# EAGLE design SX70_Flash_Tester_MINI (EAGLE 8.4.3)
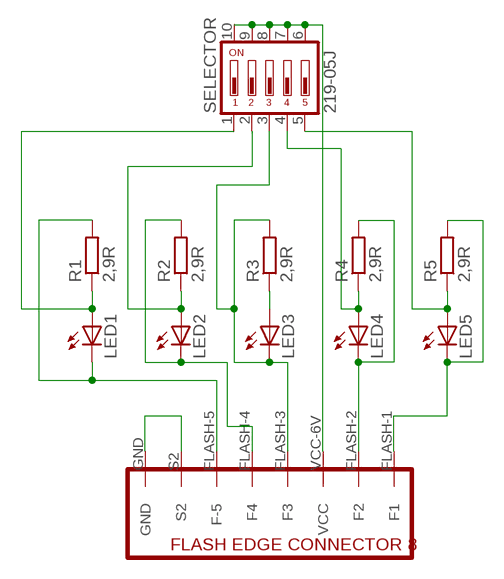
[diagram p0: schematic, sheet 1]

## Parts
FLASH_TESTER  SX70-FLASH-EDGE8-MALE  [SX70-FLASH-EDGE8]
LED1  LEDCHIPLED_0805  [CHIPLED_0805]
LED2  LEDCHIPLED_0805  [CHIPLED_0805]
LED3  LEDCHIPLED_0805  [CHIPLED_0805]
LED4  LEDCHIPLED_0805  [CHIPLED_0805]
LED5  LEDCHIPLED_0805  [CHIPLED_0805]
R1  2,9R  R-EU_M0805  [M0805]
R2  2,9R  R-EU_M0805  [M0805]
R3  2,9R  R-EU_M0805  [M0805]
R4  2,9R  R-EU_M0805  [M0805]
R5  2,9R  R-EU_M0805  [M0805]
SELECTOR  219-05J  [CTS-219-05J]

## Nets
N$1: LED1.A R1.1 SELECTOR.1
N$2: LED2.A R2.1 SELECTOR.2
N$3: LED3.A R3.1
N$4: FLASH_TESTER.VCC-6V(VCC) SELECTOR.6 SELECTOR.7 SELECTOR.8 SELECTOR.9 SELECTOR.10
N$5: LED5.A R5.1 SELECTOR.5
N$6: FLASH_TESTER.FLASH-1(F1) LED5.C R5.2
N$7: FLASH_TESTER.FLASH-2(F2) LED4.C R4.2
N$8: FLASH_TESTER.FLASH-3(F3) LED3.C R3.2 SELECTOR.3
N$9: FLASH_TESTER.FLASH-4(F4) LED2.C R2.2
N$10: FLASH_TESTER.FLASH-5(F-5) LED1.C R1.2
N$11: FLASH_TESTER.GND FLASH_TESTER.S2
N$14: LED4.A R4.1 SELECTOR.4

## Library data of the parts
FLASH_TESTER = openSX70:SX70-FLASH-EDGE8-MALE
LED1-LED5 = led:LED: LED OSRAM: - CHIPLED LG R971, LG N971, LY N971, LG Q971, LY Q971, LO R971, LY R971 LH N974, LH R974 LS Q976, LO Q976, LY Q976 LO Q996 - Hyper CHIPLED LW Q18S LB Q993, LB Q99A, LB R99A - SideLED LS A670, LO A670, LY A670, LG A670, LP A670 LB A673, LV A673, LT A673, LW A673 LH A674 LY A675 LS A676, LA A676, LO A676, LY A676, LW A676 LS A679, LY A679, LG A679 - Hyper Micro SIDELED® LS Y876, LA Y876, LO Y876, LY Y876 LT Y87S - SmartLED LW L88C, LW L88S LB L89C, LB L89S, LG L890 LS L89K, LO L89K, LY L89K LS L896, LA L896, LO L896, LY L896 - TOPLED LS T670, LO T670, LY T670, LG T670, LP T670 LSG T670, LSP T670, LSY T670, LOP T670, LYG T670 LG T671, LOG T671, LSG T671 LB T673, LV T673, LT T673, LW T673 LH T674 LS T676, LA T676, LO T676, LY T676, LB T676, LH T676, LSB T676, LW T676 LB T67C, LV T67C, LT T67C, LS T67K, LO T67K, LY T67K, LW E67C LS E67B, LA E67B, LO E67B, LY E67B, LB E67C, LV E67C, LT E67C LW T67C LS T679, LY T679, LG T679 LS T770, LO T770, LY T770, LG T770, LP T770 LB T773, LV T773, LT T773, LW T773 LH T774 LS E675, LA E675, LY E675, LS T675 LS T776, LA T776, LO T776, LY T776, LB T776 LHGB T686 LT T68C, LB T68C - Hyper Mini TOPLED® LB M676 - Mini TOPLED Santana® LG M470 LS M47K, LO M47K, LY M47K Source: http://www.osram.convergy.de LUXEON: - LUMILED® LXK2-PW12-R00, LXK2-PW12-S00, LXK2-PW14-U00, LXK2-PW14-V00 LXK2-PM12-R00, LXK2-PM12-S00, LXK2-PM14-U00 LXK2-PE12-Q00, LXK2-PE12-R00, LXK2-PE12-S00, LXK2-PE14-T00, LXK2-PE14-U00 LXK2-PB12-K00, LXK2-PB12-L00, LXK2-PB12-M00, LXK2-PB14-N00, LXK2-PB14-P00, LXK2-PB14-Q00 LXK2-PR12-L00, LXK2-PR12-M00, LXK2-PR14-Q00, LXK2-PR14-R00 LXK2-PD12-Q00, LXK2-PD12-R00, LXK2-PD12-S00 LXK2-PH12-R00, LXK2-PH12-S00 LXK2-PL12-P00, LXK2-PL12-Q00, LXK2-PL12-R00 Source: www.luxeon.com KINGBRIGHT: KA-3528ASYC Source: www.kingbright.com
R1-R5 = rcl:R-EU_: RESISTOR, European symbol
SELECTOR = switch-dil:219-05*: Surface Mount DIP Switch Series 219 SMT CTS Electronic Components Sourc: www.ctscorp.com; OC_FARNELL: unknown; OC_NEWARK: unknown

## Board
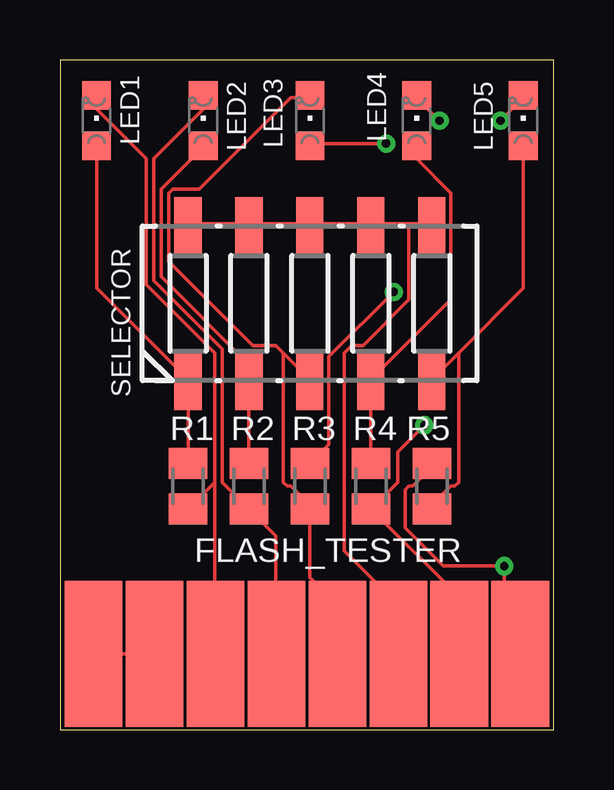
[diagram p1: board, top side]
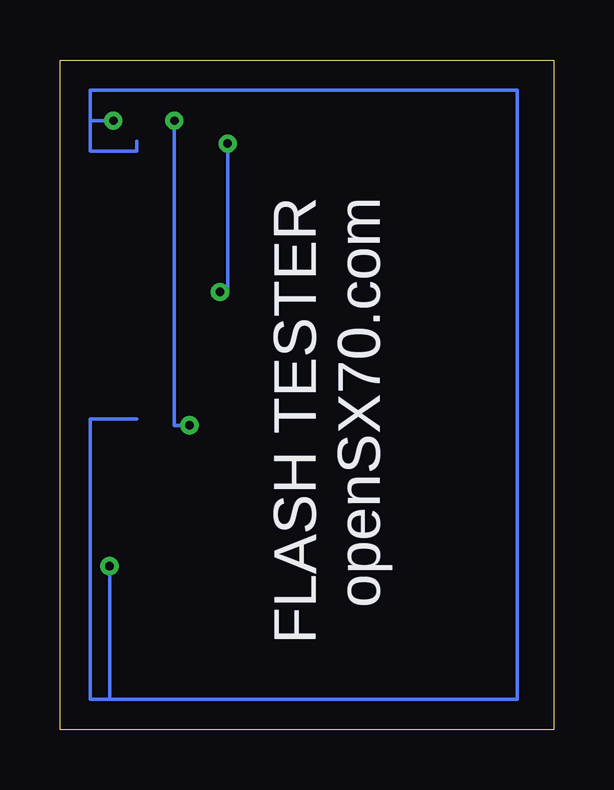
[diagram p2: board, bottom side, seen from below]

Size 20.57 x 27.93 mm. Coordinates in mm from the lower left corner, seen from the top.
Outline: 0,0 20.57,0 20.57,27.93 0,27.93 0,0
Copper layers (1*16): Top 0.035mm / dielectric 1.5mm / Bottom 0.035mm
Design rules "default": minimum track width 6mil, minimum drill 0.35mm, track to track 6mil, track to pad 6mil, pad to pad 6mil, via to via 6mil, smd to smd 6mil, copper to edge 40mil, drill to drill 6mil, minimum pad ring 10mil, minimum via ring 8mil, stop-mask expansion 4mil, vias tented up to drill 0mil, thermal gap 10mil

### Footprints (pad centres in the part's own frame; a part is rotated, then mirrored left to right if it is on the bottom)
SX70-FLASH-EDGE8 = smd 2.4 x 6.09: FLASH-1 8.89,0.001; FLASH-2 6.35,0.001; FLASH-3 1.27,0.001; FLASH-4 -1.27,0.001; FLASH-5 -3.81,0.001; GND -8.89,0.001; S2 -6.35,0.001; VCC-6V 3.81,0.001
CHIPLED_0805 = smd 1.2 x 1.2: A 0,-1.05; C 0,1.05
M0805 = smd 1.3 x 1.6: 1 -0.95,0; 2 0.95,0
CTS-219-05J = smd 1.13 x 2.44: 1 -5.08,-3.215; 2 -2.54,-3.215; 3 0,-3.215; 4 2.54,-3.215; 5 5.08,-3.215; 6 5.08,3.215; 7 2.54,3.215; 8 0,3.215; 9 -2.54,3.215; 10 -5.08,3.215

### Placement (x,y rotation side)
FLASH_TESTER  10.29,3.17 0 top
LED1  1.52,25.4 0 top
LED2  5.97,25.4 0 top
LED3  10.41,25.4 0 top
LED4  14.86,25.4 0 top
LED5  19.3,25.4 0 top
R1  5.33,10.16 270 top
R2  7.87,10.16 270 top
R3  10.41,10.16 270 top
R4  12.95,10.16 270 top
R5  15.49,10.16 90 top
SELECTOR  10.41,17.78 0 top

### Tracks (layer width: path | path; a pad name or v marks a point on that pad's centre or on a via)
N$1
  Top 0.152: LED1.A 1.52,18.41 5.33,14.61 SELECTOR.1 R1.1
N$2
  Top 0.152: LED2.A 5.97,24.29 4.22,22.54 4.22,18.89 7.87,15.24 SELECTOR.2 R2.1
N$3  (via drill 0.35)
  Top 0.152: v13.59,24.45 10.41,24.45 LED3.A | v13.91,18.26 11.21,15.56 11.21,11.91 R3.1
  Bottom 0.152: v13.59,24.45 13.59,18.26 v13.91,18.26
N$4
  Top 0.152: 7.87,21.11 5.33,21.11 SELECTOR.10 | 7.87,21.11 10.41,21.11 | 7.87,21.11 SELECTOR.9 | 10.41,21.11 12.95,21.11 | 10.41,21.11 SELECTOR.8 | 12.95,21.11 14.54,21.11 | 14.54,21.11 15.49,21.11 SELECTOR.6 | 12.95,21.11 SELECTOR.7 | 14.54,21.11 14.54,17.94 12.64,16.03 12.16,16.03 11.84,15.72 11.84,7.46 14.07,5.24 14.07,3.33 FLASH_TESTER.VCC-6V
N$5
  Top 0.152: LED5.A 19.3,18.41 16.61,15.72 | 16.61,15.72 15.49,14.61 SELECTOR.5 | 16.61,15.72 16.61,10.32 16.45,10.16 16.29,10.16 15.49,9.37 R5.1
N$6  (via drill 0.35)
  Top 0.152: v18.35,25.4 19.3,26.35 LED5.C | FLASH_TESTER.FLASH-1 19.14,3.33 18.51,3.97 v18.51,6.83 15.97,6.83 14.38,8.41 14.38,10 14.54,10.16 14.7,10.16 15.49,10.95 R5.2
  Bottom 0.152: 17.37,12.95 19.3,12.95 19.3,1.27 18.51,1.27 | 18.51,1.27 1.52,1.27 1.52,26.67 16.76,26.67 17.37,26.67 19.3,26.67 19.3,25.4 | 17.37,24.54 17.37,24.13 19.3,24.13 19.3,25.4 | 19.3,25.4 v18.35,25.4 | v18.51,6.83 18.51,1.27
N$7  (via drill 0.35)
  Top 0.152: v15.81,25.4 14.86,26.35 LED4.C | v15.18,12.7 14.07,11.59 14.07,10.32 R4.2 | R4.2 16.61,5.56 16.61,3.33 FLASH_TESTER.FLASH-2 | R4.2
  Bottom 0.152: v15.81,25.4 15.81,12.7 v15.18,12.7
N$8
  Top 0.152: FLASH_TESTER.FLASH-3 11.52,3.33 11.52,5.24 10.41,6.35 R3.2 10.41,9.37 9.62,10.16 9.46,10.16 9.3,10.32 9.3,15.72 | 9.3,15.72 10.41,14.61 SELECTOR.3 | 9.3,15.72 8.98,16.03 8.03,16.03 4.54,19.53 4.54,22.38 4.7,22.54 5.81,22.54 9.62,26.35 10.41,26.35 LED3.C
N$9
  Top 0.152: LED2.C 5.97,25.88 3.9,23.81 3.9,18.73 6.76,15.88 6.76,10.32 R2.2 | R2.2 8.98,8.1 8.98,3.33 FLASH_TESTER.FLASH-4 | R2.2
N$10
  Top 0.152: LED1.C 1.52,25.88 3.59,23.81 3.59,18.57 6.45,15.72 6.45,10.32 | 6.45,10.32 R1.2 | 6.45,10.32 6.45,3.33 FLASH_TESTER.FLASH-5
N$11
  Top 0.152: FLASH_TESTER.GND 1.52,3.17 3.9,3.17 FLASH_TESTER.S2
N$14
  Top 0.152: LED4.A 14.86,23.81 16.29,22.38 16.29,17.94 12.95,14.61 SELECTOR.4 R4.1

### Text on the board
Bottom: FLASH TESTER / openSX70.com
bPlace: FLASH TESTER / openSX70.com